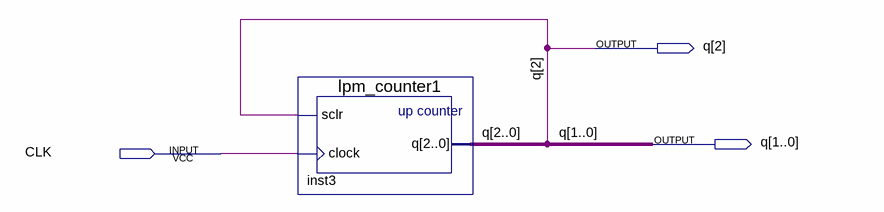
[diagram p0: schematic sheet]
// Quartus schematic 3-Bit-Reset-Counter.bdf as structural Verilog: 1 symbols, 3 pins
module \3-Bit-Reset-Counter  (
  input  CLK,
  output [2:0] q
);

  lpm_counter1 inst3 (.sclr(q[2]), .clock(CLK), .q(q));
endmodule
